# Altium schematic sheet pca20054_sheet4_power_control.SchDoc: PCA20054 - Power and Control
size A3; Organization: Nordic Semiconductor; DocumentNumber: 1; Revision: 1.0.0; SheetNumber: 4; SheetTotal: 5; Date: 2020-02-07; CompanyName: Nordic Semiconductor; DrawnBy: KJP; ProjectNumber: 4467
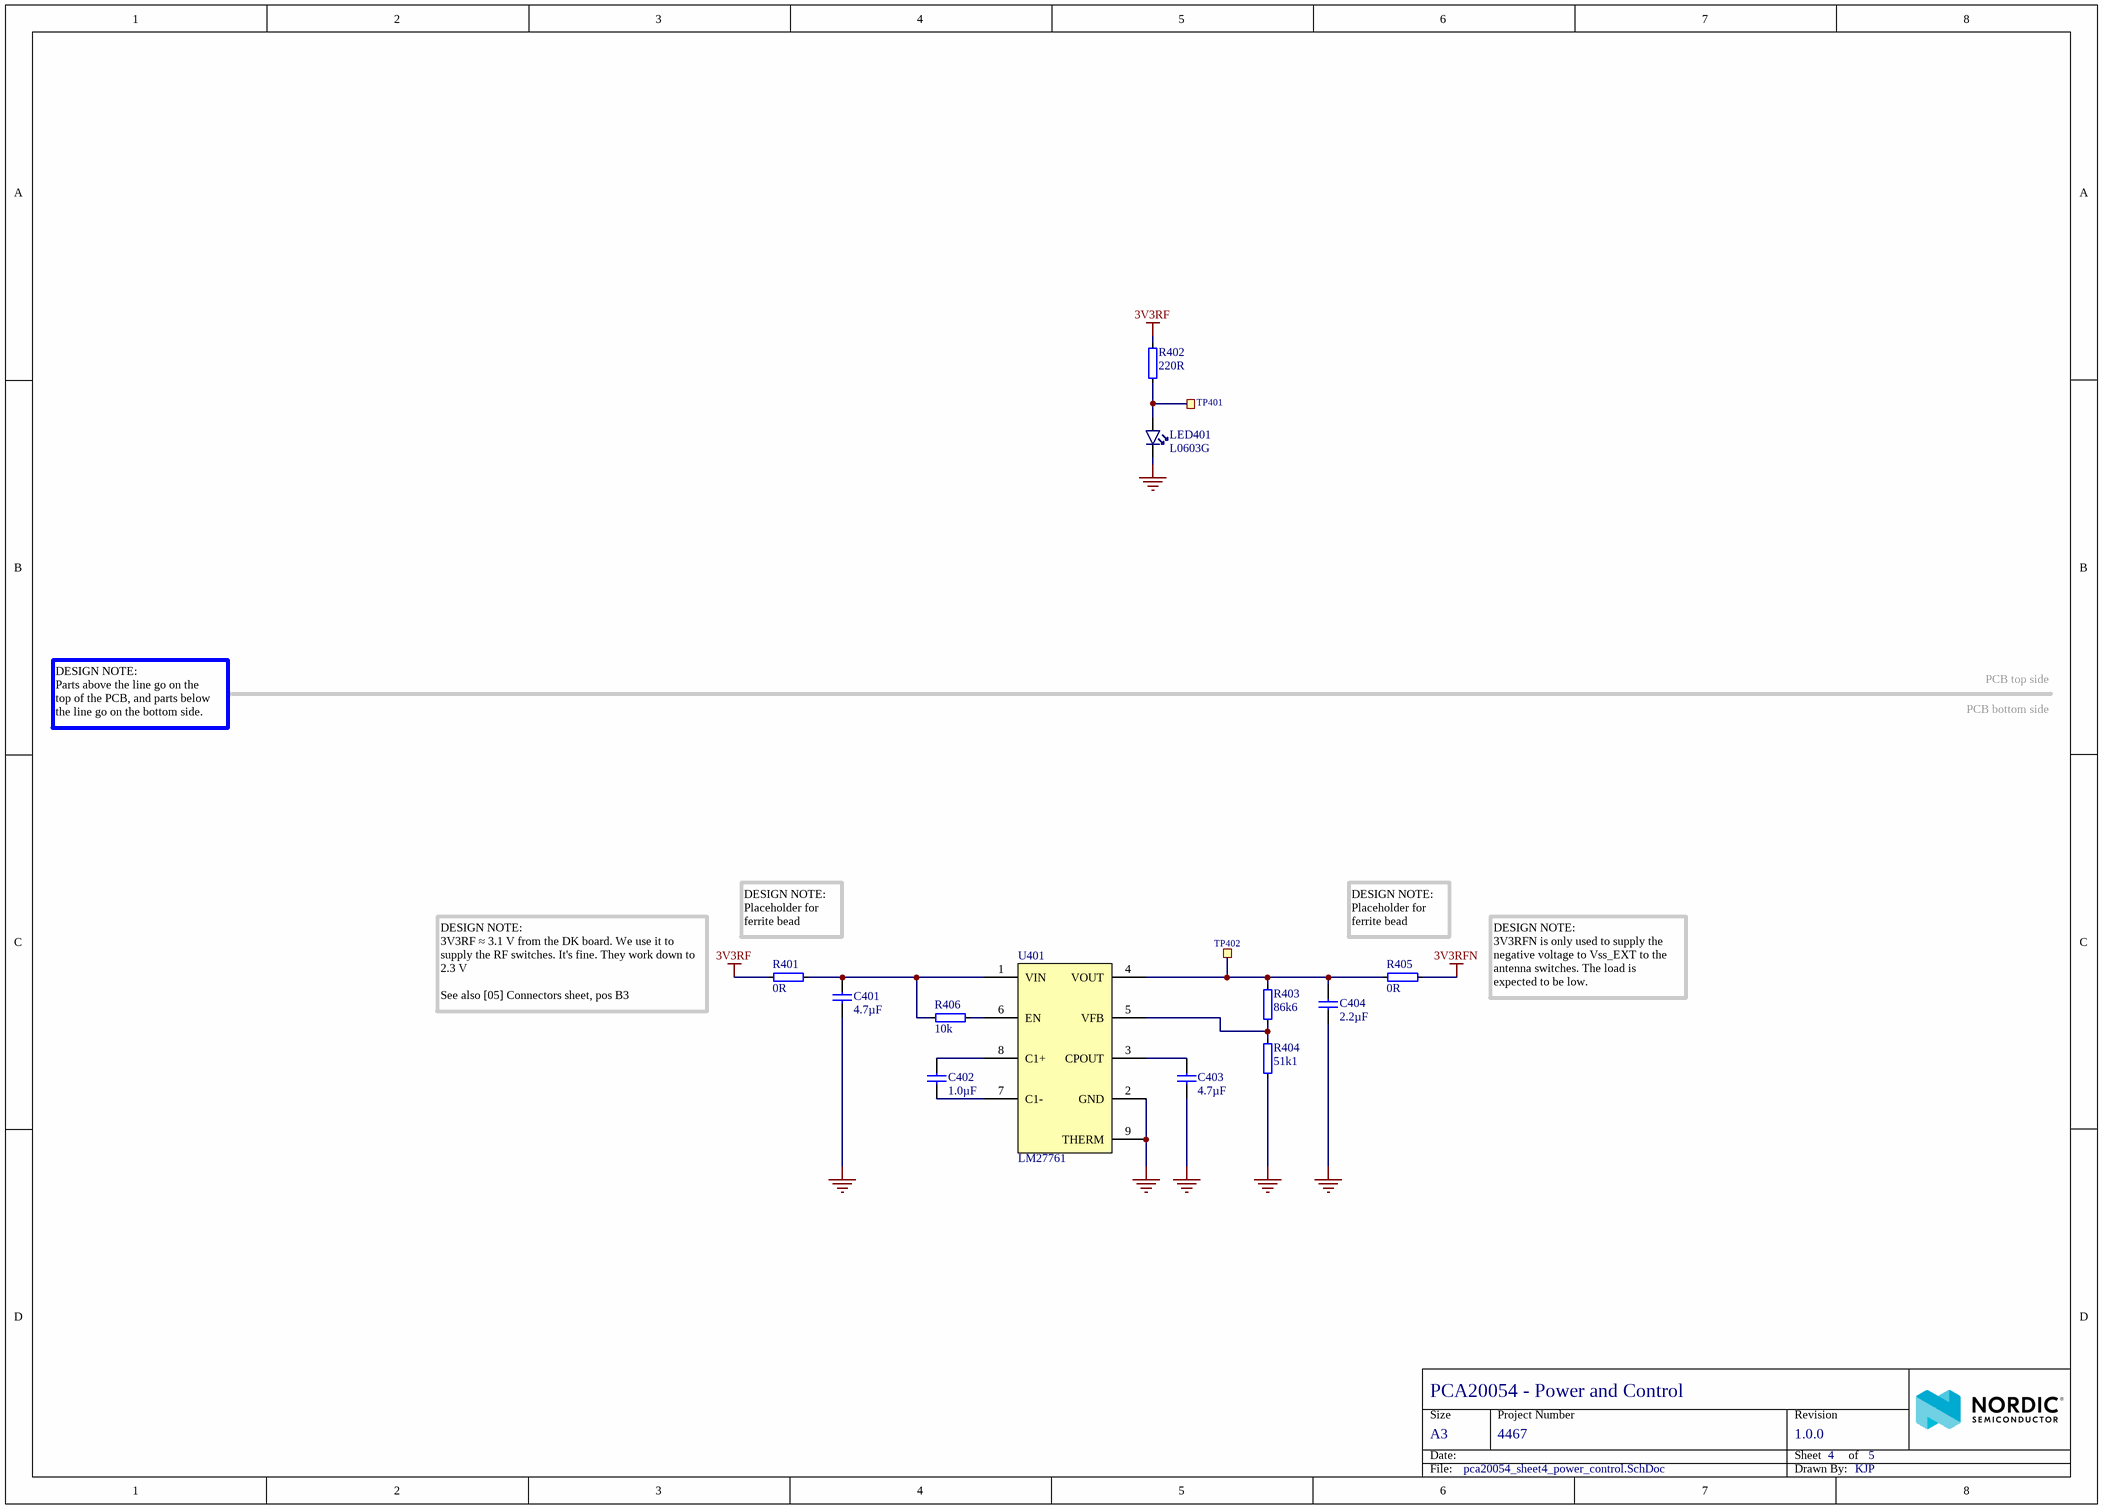
[diagram p0: pca20054_sheet4_power_control.SchDoc]

## Parts
C401  4.7µF  [CAPC1608X06L]
C402  1.0µF  [CAPC1608X06L]
C403  4.7µF  [CAPC1608X06L]
C404  2.2µF  [CAPC1608X06L]
LED401  L0603G  [LED_0603_G]
R401  0R  [RESC1005X04L]
R402  220R  [RESC1005X04L]
R403  86k6  [RESC1005X04L]
R404  51k1  [RESC1005X04L]
R405  0R  [RESC1005X04L]
R406  10k  [RESC1005X04L]
TP401  Ø1.0mm,SMD  [TP_SMD_?.0mm]  (value not drawn)  (no BOM)
TP402  Ø1.0mm,SMD  [TP_SMD_?.0mm]  (value not drawn)  (no BOM)
U401  LM27761  [SON50P200X80_HS-9L]

## Nets
3V3RF: R401.1 R402.2
3V3RFN: R405.2
GND: C401.1 C403.1 C404.1 LED401.1(C) R404.1 U401.2(GND) U401.9(THERM)
NetC401_2: C401.2 R401.2 R406.1 U401.1(VIN)
NetC402_1: C402.1 U401.7(C1-)
NetC402_2: C402.2 U401.8(C1+)
NetC403_2: C403.2 U401.3(CPOUT)
NetC404_2: C404.2 R403.2 R405.1 TP402.1 U401.4(VOUT)
NetLED401_2: LED401.2(A) R402.1 TP401.1
NetR403_1: R403.1 R404.2 U401.5(VFB)
NetR406_2: R406.2 U401.6(EN)

## Notes on the sheet
- DESIGN NOTE:
  Parts above the line go on the
  top of the PCB, and parts below
  the line go on the bottom side.
- PCB bottom side
- PCB top side
- DESIGN NOTE:
  Placeholder for ferrite bead
- (near R405) DESIGN NOTE:
  Placeholder for ferrite bead
- DESIGN NOTE:
  3V3RFN is only used to supply the
  negative voltage to Vss_EXT to the
  antenna switches. The load is
  expected to be low.
- DESIGN NOTE:
  3V3RF ≈ 3.1 V from the DK board. We use it to supply the RF switches. It's fine. They work down to 2.3 V
  See also [05] Connectors sheet, pos B3
- Size
- Date:
- A3
- Project Number
- Sheet         of
- Revision
- File:
- Drawn By:

## Library data of the parts
C401 C403 = C0603-4µ7: Capacitor, X5R, ±10%; Part number IPS: 00000007783; Note: 6.3V; Artikkelnr Noca: 20069060; Part Number: C0603-4µ7; Manufacturer: *; Manufacturer Part Number: *; ComponentLink1URL: *; ComponentLink1Description: Datasheet; ComponentLink2URL: *; ComponentLink2Description: Supplier link; HelpURL: *; Footprint Doc: 0603; LatestRevisionDate: 2009-11-23; Pin Count: 2; Publisher: Nordic Semiconductor; Published: 2009-05-08; Value: 4.7µF; Supplier 1: *; Supplier Part Number 1: *; Supplier 2: *; Supplier Part Number 2: *
C402 = C0603-1µ0: Capacitor, X7R, ±10%; Part number IPS: 00000000616; Note: 16V; Artikkelnr Noca: 20039282; Part Number: C0603-1µ0; Manufacturer: *; Manufacturer Part Number: *; ComponentLink1URL: *; ComponentLink1Description: Datasheet; ComponentLink2URL: *; ComponentLink2Description: Supplier link; HelpURL: *; Footprint Doc: 0603; LatestRevisionDate: 2013-06-05; Pin Count: 2; Publisher: Nordic Semiconductor; Published: 2009-05-08; Value: 1.0µF; Supplier 1: *; Supplier Part Number 1: *; Supplier 2: *; Supplier Part Number 2: *
C404 = C0603-2µ2: Capacitor, X7R, ±10%; Part number IPS: N.A.; Note: 6.3V; Artikkelnr Noca: 20039322; Part Number: C0603-2µ2; Manufacturer: *; Manufacturer Part Number: *; ComponentLink1URL: *; ComponentLink1Description: Datasheet; ComponentLink2URL: *; ComponentLink2Description: Supplier link; HelpURL: *; Footprint Doc: 0603; LatestRevisionDate: 2016-10-10; Pin Count: 2; Publisher: Nordic Semiconductor; Published: 2009-05-08; Value: 2.2µF; Supplier 1: *; Supplier Part Number 1: *; Supplier 2: *; Supplier Part Number 2: *
LED401 = LG L29K Smartled Green: LED, Green, 0603, 570nm, Vf=1.7V, 2.24..5.6mcd, - 40 to +100°C; Manufacturer: Osram; Manufacturer Part Number: LG L29K-G2J1-24-Z; Part number IPS: 00000009961; Note: 2.24..5.6 mcd, Vfmin=1.7V; Artikkelnr Noca: 13019147; Part Number: LG L29K Smartled Green; ComponentLink1URL: *; ComponentLink1Description: Datasheet; ComponentLink2URL: *; ComponentLink2Description: Supplier link; HelpURL: http://www.osram-os.com/Graphics/XPic2/00077107_0.pdf; Footprint Doc: 0603; LatestRevisionDate: 2017-08-21; Pin Count: 2; Publisher: Nordic Semiconductor; Published: 2014-10-28; Value: L0603G; Supplier 1: Digi-Key; Supplier Part Number 1: 475-2709-1-ND; Supplier 2: Mouser; Supplier Part Number 2: 720-LGL29KG2J124Z
R401 R405 = R0402-0R: Resistor, ±5%, 0.063W; Part number IPS: 00000007128; Note: Chip Res 5%; Artikkelnr Noca: 27049000; Part Number: R0402-0R; Manufacturer: *; Manufacturer Part Number: *; ComponentLink1URL: *; ComponentLink1Description: Datasheet; ComponentLink2URL: *; ComponentLink2Description: Supplier link; HelpURL: *; Footprint Doc: 0402; LatestRevisionDate: 2009-11-23; Pin Count: 2; Publisher: Nordic Semiconductor; Published: 2009-05-08; Value: 0R; Supplier 1: Farnell; Supplier Part Number 1: 146-9661; Supplier 2: *; Supplier Part Number 2: *
R402 = R0402-220: Resistor, ±1%, 0.063W; Part number IPS: N.A.; Note: Chip Res 1%; Artikkelnr Noca: 27049057; Part Number: R0402-220; Manufacturer: *; Manufacturer Part Number: *; ComponentLink1URL: *; ComponentLink1Description: Datasheet; ComponentLink2URL: *; ComponentLink2Description: Supplier link; HelpURL: *; Footprint Doc: 0402; LatestRevisionDate: 2009-11-23; Pin Count: 2; Publisher: Nordic Semiconductor; Published: 2009-05-08; Value: 220R; Supplier 1: Farnell; Supplier Part Number 1: 173-8841; Supplier 2: *; Supplier Part Number 2: *
R403 = R0402-86k6: Resistor, ±1%, 0.063W; Manufacturer: Panasonic; Manufacturer Part Number: ERJ-2RKF8662X; Part number IPS: N.A.; Note: Chip Res 1%; Artikkelnr Noca: 27049119; Part Number: R0402-86k6; ComponentLink1URL: *; ComponentLink1Description: Datasheet; ComponentLink2URL: *; ComponentLink2Description: Supplier link; HelpURL: *; Footprint Doc: 0402; LatestRevisionDate: 2009-11-23; Pin Count: 2; Publisher: Nordic Semiconductor; Published: 2009-05-08; Value: 86k6; Supplier 1: Digi-Key; Supplier Part Number 1: P86.6KLCT-ND; Supplier 2: Mouser; Supplier Part Number 2: 667-ERJ-2RKF8662X
R404 = R0402-51k1: Resistor, ±0.1%, 0.063W; Manufacturer: Panasonic; Manufacturer Part Number: ERA-2AEB5112X; Note: Chip Res 1%; Artikkelnr Noca: N.A.; Part Number: R0402-51k1; ComponentLink1URL: *; ComponentLink1Description: Datasheet; ComponentLink2URL: *; ComponentLink2Description: Supplier link; HelpURL: *; Footprint Doc: 0402; LatestRevisionDate: 2016-11-24; Pin Count: 2; Publisher: Nordic Semiconductor; Published: 2016-11-24; Value: 51k1; Supplier 1: Digi-Key; Supplier Part Number 1: P51.1KDCCT-ND; Supplier 2: Mouser; Supplier Part Number 2: 667-ERA-2AEB5112X; Part number IPS: N.A.
R406 = R0402-10k: Resistor, ±1%, 0.063W; Part number IPS: 00000002093; Note: Chip Res 1%; Artikkelnr Noca: 27049097; Part Number: R0402-10k; Manufacturer: *; Manufacturer Part Number: *; ComponentLink1URL: *; ComponentLink1Description: Datasheet; ComponentLink2URL: *; ComponentLink2Description: Supplier link; HelpURL: *; Footprint Doc: 0402; LatestRevisionDate: 2009-11-23; Pin Count: 2; Publisher: Nordic Semiconductor; Published: 2009-05-08; Value: 10k; Supplier 1: Farnell; Supplier Part Number 1: 173-8864; Supplier 2: *; Supplier Part Number 2: *
TP401 TP402 = TP_SMD_Ø1.0MM: 1.0mm circular SMD testpad; Manufacturer: Nordic Semiconductor; Artikkelnr Noca: N.A.; Part Number: TP_SMD_Ø1.0MM; Manufacturer Part Number: *; ComponentLink1URL: *; ComponentLink1Description: Datasheet; ComponentLink2URL: *; ComponentLink2Description: Supplier link; HelpURL: *; Footprint Doc: TP_SMD_Ø1.0mm; LatestRevisionDate: 2013-06-11; Pin Count: 1; Publisher: Nordic Semiconductor; Published: 2013-06-11; Value: Ø1.0mm,SMD; Note: *; Supplier 1: *; Supplier Part Number 1: *; Supplier 2: *; Supplier Part Number 2: *; Part number IPS: N.A.
U401 = LM27761: Low-Noise, Regulated, Switched-Capacitor Voltage Inverter; Manufacturer: Texas Instruments; Note: DSGT: 250 pts reel; Artikkelnr Noca: N.A.; Part Number: LM27761; Manufacturer Part Number: LM27761; ComponentLink1URL: http://www.ti.com/lit/ds/symlink/lm27761.pdf; ComponentLink1Description: Datasheet; ComponentLink2URL: https://www.digikey.com/product-detail/en/texas-instruments/LM27761DSGT/296-43882-1-ND/5880550; ComponentLink2Description: Supplier link; HelpURL: https://www.ti.com/product/LM27761; Footprint Doc: WSON-8; LatestRevisionDate: 2020-01-17; Pin Count: 8; Publisher: Nordic Semiconductor; Published: 2020-01-17; Value: LM27761; Supplier 1: Digi-Key; Supplier Part Number 1: 296-43882-1-ND; Supplier 2: Mouser; Supplier Part Number 2: 595-LM27761DSGR; Part number IPS: N.A.